# EAGLE design LightSensor (EAGLE 7.3.0)
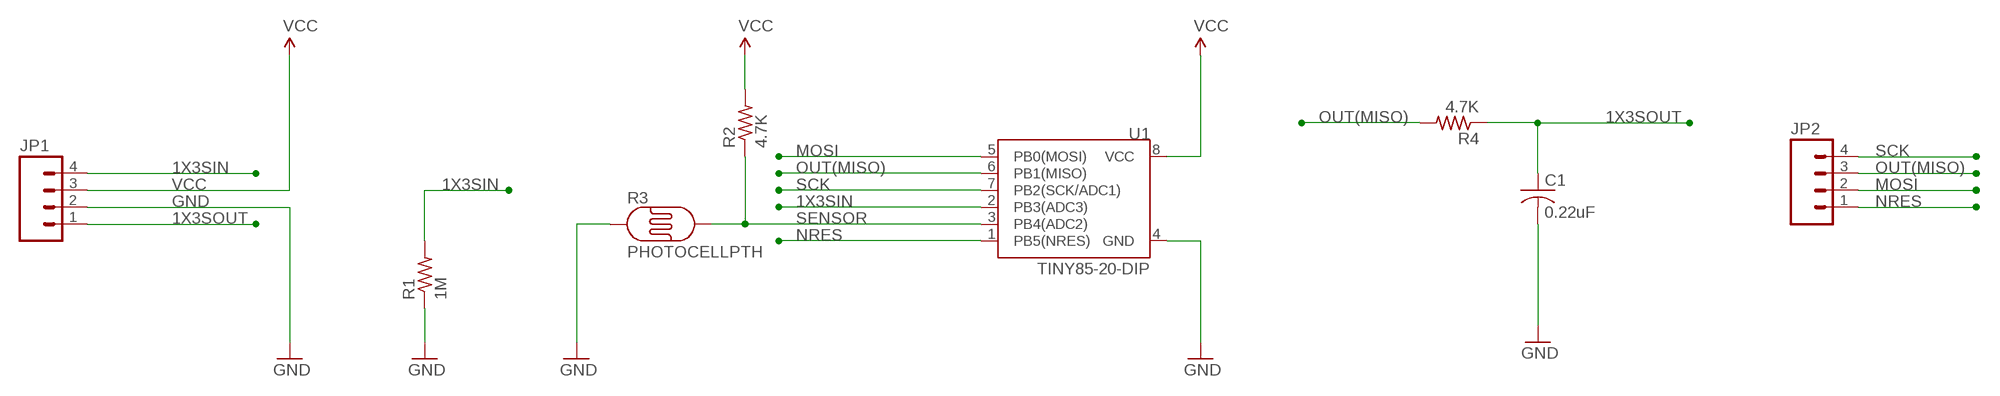
[diagram p0: schematic, sheet 1]

## Parts
C1  0.22uF  C-USC0402  [C0402]
JP1  M04PTH  [1X04]
JP2  M04PTH  [1X04]
R1  1M  R-US_R0603  [R0603]
R2  4.7K  R-US_R0603  [R0603]
R3  PHOTOCELLPTH  [PHOTOCELL]
R4  4.7K  R-US_R0603  [R0603]
U1  TINY85-20-DIP  ATTINY45TINY85-20-DIP  [DIP08]

## Nets
1X3SIN: JP1.4 R1.2 U1.2(PB3(ADC3))
1X3SOUT: C1.1 JP1.1 R4.1
GND: C1.2 JP1.2 R1.1 R3.1 U1.4(GND)
MOSI: JP2.2 U1.5(PB0(MOSI))
NRES: JP2.1 U1.1(PB5(NRES))
OUT(MISO): JP2.3 R4.2 U1.6(PB1(MISO))
SCK: JP2.4 U1.7(PB2(SCK/ADC1))
SENSOR: R2.1 R3.2 U1.3(PB4(ADC2))
VCC: JP1.3 R2.2 U1.8(VCC)

## Library data of the parts
C1 = adafruit:C-US: CAPACITOR, American symbol
JP1 JP2 = SparkFun-Connectors:M04: Header 4 Standard 4-pin 0.1" header. Use with straight break away headers (SKU : PRT-00116), right angle break away headers (PRT-00553), swiss pins (PRT-00743), machine pins (PRT-00117), and female headers (PRT-00115). Molex polarized connector foot print use with SKU : PRT-08231 with associated crimp pins and housings. 1MM SMD Version SKU: PRT-10208
R1 R2 R4 = adafruit:R-US_: RESISTOR, American symbol
R3 = SparkFun-Sensors:PHOTOCELL: CdS photoresistor. This is a low cost way to detect light levels. Resistance decreases with more incoming light. SparkFun SKU: SEN-09088
U1 = SparkFun-DigitalIC:ATTINY45: Atmel 8-pin 2/4/8kB flash uC; PROD_ID: IC-09445

## Board
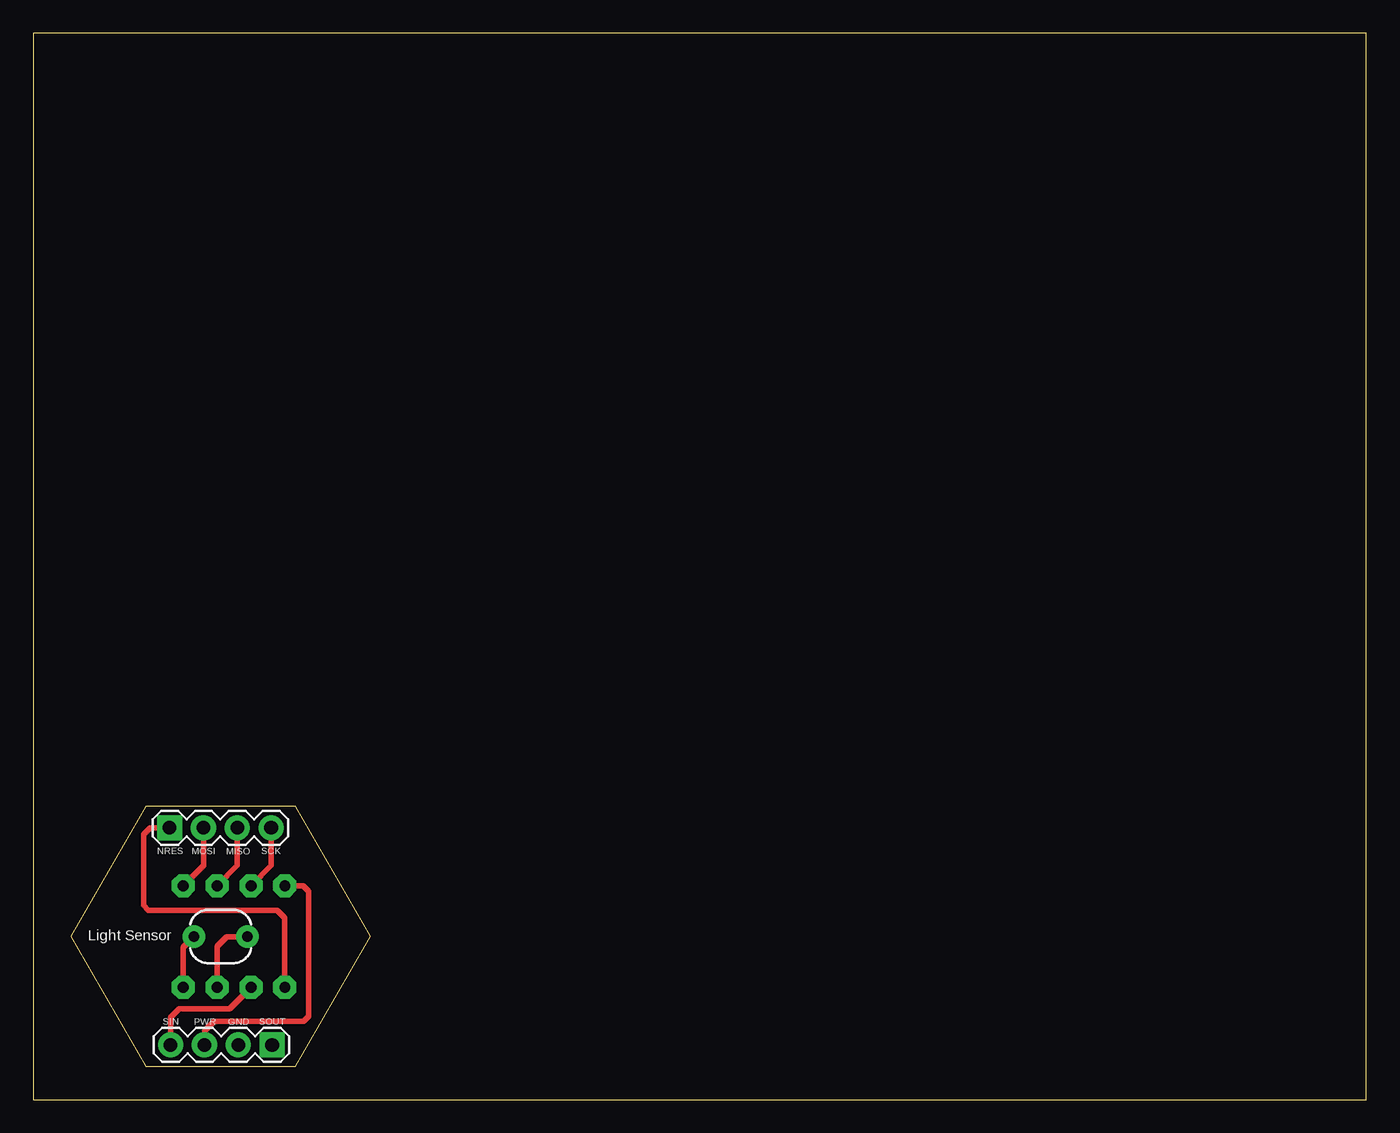
[diagram p1: board, top side]
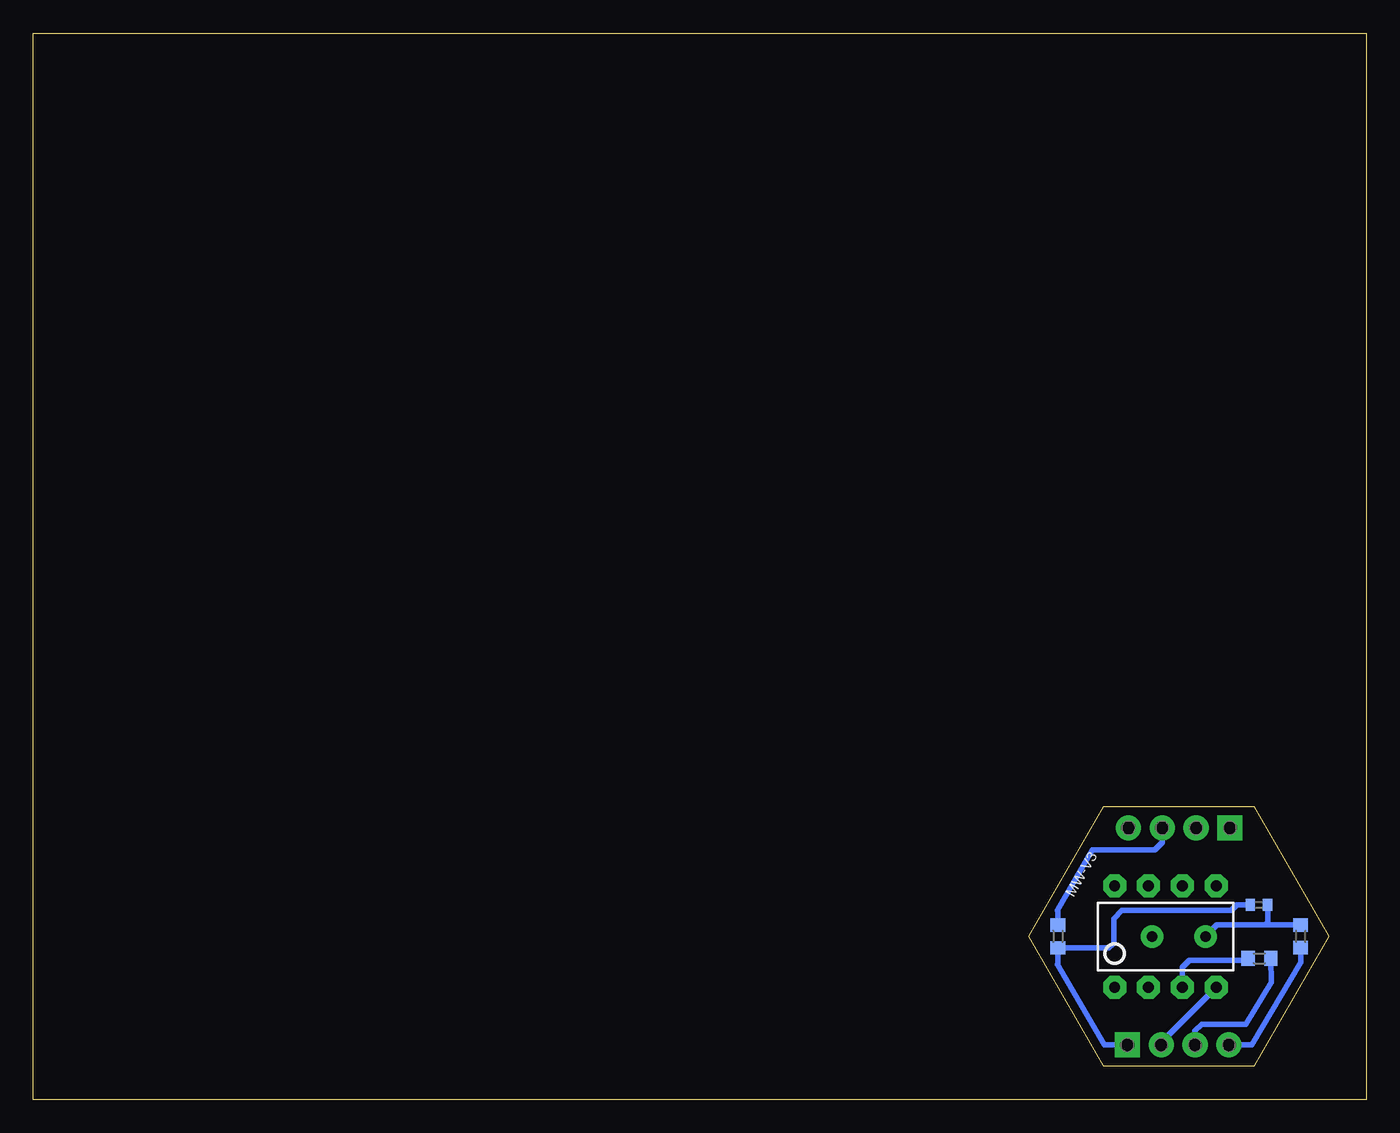
[diagram p2: board, bottom side, seen from below]

Size 100 x 80 mm. Coordinates in mm from the lower left corner, seen from the top.
Outline: 0,0 100,0 100,80 0,80 0,0
Outline: 8.45,2.5 19.7,2.5 25.32,12.24 19.7,21.98 8.45,21.98 2.82,12.24 8.45,2.5
Copper layers (1*16): Top 0.035mm / dielectric 1.5mm / Bottom 0.035mm
Design rules "default": minimum track width 10mil, minimum drill 24mil, track to track 8mil, track to pad 8mil, pad to pad 8mil, via to via 8mil, smd to smd 8mil, copper to edge 40mil, drill to drill 8mil, minimum pad ring 10mil, minimum via ring 8mil, stop-mask expansion 4mil, vias tented up to drill 0mil, thermal gap 10mil

### Footprints (pad centres in the part's own frame; a part is rotated, then mirrored left to right if it is on the bottom)
C0402 = smd 0.7 x 0.9: 1 -0.65,0; 2 0.65,0
1X04 = drill 1.016 pad 1.88 square: 1 0,0 | drill 1.016 pad 1.88: 2 2.54,0; 3 5.08,0; 4 7.62,0
R0603 = smd 1 x 1.1: 1 -0.85,0; 2 0.85,0
PHOTOCELL = drill 0.8 pad 1.676: 1 -2,0; 2 2,0
DIP08 = drill 0.813 pad 1.727 octagon: 1 -3.81,-3.81; 2 -1.27,-3.81; 3 1.27,-3.81; 4 3.81,-3.81; 5 3.81,3.81; 6 1.27,3.81; 7 -1.27,3.81; 8 -3.81,3.81

### Placement (x,y rotation side)
C1  8.04,14.61 0 bottom
JP1  17.92,4.1 180 top
JP2  10.22,20.38 0 top
R1  4.91,12.24 270 bottom
R2  8,10.59 0 bottom
R3  14.06,12.23 0 top
R4  23.13,12.23 90 bottom
U1  15.06,12.23 0 bottom

### Tracks (layer width: path | path; a pad name or v marks a point on that pad's centre or on a via)
1X3SIN
  Top 0.4: JP1.4 10.3,6.18 10.94,6.82 14.73,6.82 U1.2
  Bottom 0.4: R1.2 4.92,10.29 8.59,4.1 JP1.4
1X3SOUT
  Bottom 0.4: JP1.1 19.65,4.1 23.15,10.16 23.13,10.19 R4.1 23.11,11.37 19.32,11.37 18.95,11.73 18.95,13.55 18.31,14.19 10.11,14.19 9.69,14.61 C1.1
GND
  Top 0.4: U1.4 11.25,11.42 R3.1
  Bottom 0.4: JP1.2 15.38,4.29 U1.4 | R1.1 7.61,13.09 | 7.61,13.09 11.2,13.09 R3.1 | C1.2 7.39,13.31 7.61,13.09
MOSI
  Top 0.4: JP2.2 12.76,17.55 U1.5
NRES
  Top 0.4: JP2.1 8.78,20.38 8.28,19.89 8.28,14.55 8.64,14.2 18.3,14.2 18.87,13.63 U1.1
OUT(MISO)
  Top 0.4: JP2.3 15.3,17.55 U1.6
  Bottom 0.4: R4.2 23.13,14.17 23.15,14.2 20.54,18.73 15.85,18.73 15.3,19.28 JP2.3
SCK
  Top 0.4: JP2.4 17.84,17.55 U1.7
SENSOR
  Top 0.4: U1.3 13.79,11.49 14.52,12.22 16.05,12.22 R3.2
  Bottom 0.4: U1.3 13.79,9.92 13.26,10.45 8.99,10.45 R2.1
VCC
  Top 0.4: U1.8 20.24,16.04 20.66,15.62 20.66,6.25 20.27,5.86 13.55,5.86 12.84,5.14 JP1.3
  Bottom 0.4: JP1.3 12.84,5.14 12.33,5.65 9.04,5.65 9.03,5.64 7.14,8.8 R2.2

### Text on the board
tPlace: NRES | MOSI | MISO | SCK | Light Sensor | SIN | PWR | GND | SOUT
bPlace: MW-V3